# Altium schematic sheet BAT54C,2151_BAT54C,215.schdoc
size 124 x 101 mm
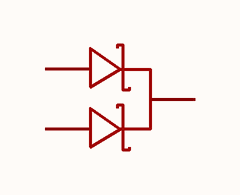
[diagram p0: BAT54C,2151_BAT54C,215.schdoc]

## Parts
D?  BAT54C,215  [SOT-23-3_L2.9-W1.6-P1.90-LS2.8-BR]  (value not drawn)

## Nets

Not connected (* = marked no-connect by the designer): D? 1(A) 2(A) 3(K)

## Library data of the parts
D? = BAT54C,215: Manufacturer: Nexperia(安世); Add into BOM: yes; Diode Configuration: 1对共阴极; Voltage - Forward(Vf@If): 800mV@100mA; Voltage - DC Reverse(Vr): 30V; Current - Rectified: 200mA; Reverse Leakage Current (Ir): 2uA@25V; Non-Repetitive Peak Forward Surge Current: 600mA; Symbol: BAT54C,215; Device: BAT54C,215; LCSC Part Name: 电压:30V 电流:200mA; Supplier Part: C37704; Manufacturer Part: BAT54C,215; Supplier Footprint: SOT-23; JLCPCB Part Class: Extended Part; Datasheet: https://item.szlcsc.com/datasheet/BAT54C%252C215/38684.html; Supplier: LCSC; Convert to PCB: yes